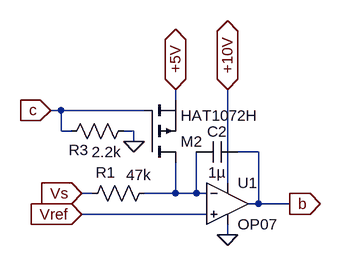
[diagram p0: schematic FeedbackControl.asc]
FeedbackControl.asc, the LTspice schematic file:
Version 4
SHEET 1 932 680
WIRE 544 336 544 320
WIRE 368 352 352 352
WIRE 496 352 368 352
WIRE 368 384 368 352
WIRE 384 384 368 384
WIRE 480 384 464 384
WIRE 480 400 480 384
WIRE 672 416 640 416
WIRE 624 464 624 320
WIRE 416 480 400 480
WIRE 544 480 544 432
WIRE 544 480 496 480
WIRE 576 480 576 416
WIRE 576 480 544 480
WIRE 592 480 576 480
WIRE 672 496 672 416
WIRE 672 496 656 496
WIRE 720 496 672 496
WIRE 592 512 400 512
WIRE 624 544 624 528
FLAG 624 320 +10V
IOPIN 624 320 BiDir
FLAG 544 320 +5V
IOPIN 544 320 BiDir
FLAG 400 512 Vref
IOPIN 400 512 In
FLAG 400 480 Vs
IOPIN 400 480 In
FLAG 624 544 0
FLAG 480 400 0
FLAG 352 352 c
IOPIN 352 352 In
FLAG 720 496 b
IOPIN 720 496 Out
SYMBOL pmos 496 432 M180
SYMATTR InstName M2
SYMATTR Value HAT1072H
SYMBOL Opamps/OP07 624 432 R0
SYMATTR InstName U1
SYMBOL res 512 464 R90
WINDOW 0 -1 75 VBottom 2
WINDOW 3 -28 24 VTop 2
SYMATTR InstName R1
SYMATTR Value 47k
SYMBOL res 480 368 R90
WINDOW 0 61 85 VBottom 2
WINDOW 3 33 42 VTop 2
SYMATTR InstName R3
SYMATTR Value 2.2k
SYMBOL cap 640 400 R90
WINDOW 0 0 32 VBottom 2
WINDOW 3 32 32 VTop 2
SYMATTR InstName C2
SYMATTR Value 1µ

The netlist it stands for:
* FeedbackControl.asc
M2 N001 c +5V +5V HAT1072H
XU1 Vref N001 +10V 0 b LT1001  ; OP07, pins In+ In- V+ V- OUT
R1 N001 Vs 47k
R3 0 c 2.2k
C2 b N001 1µ
.model NMOS NMOS
.model PMOS PMOS
.lib standard.mos
.lib LTC.lib
.backanno
.end